# Altium schematic sheet Interface.SchDoc
size A4; SheetNumber: 2; SheetTotal: 5
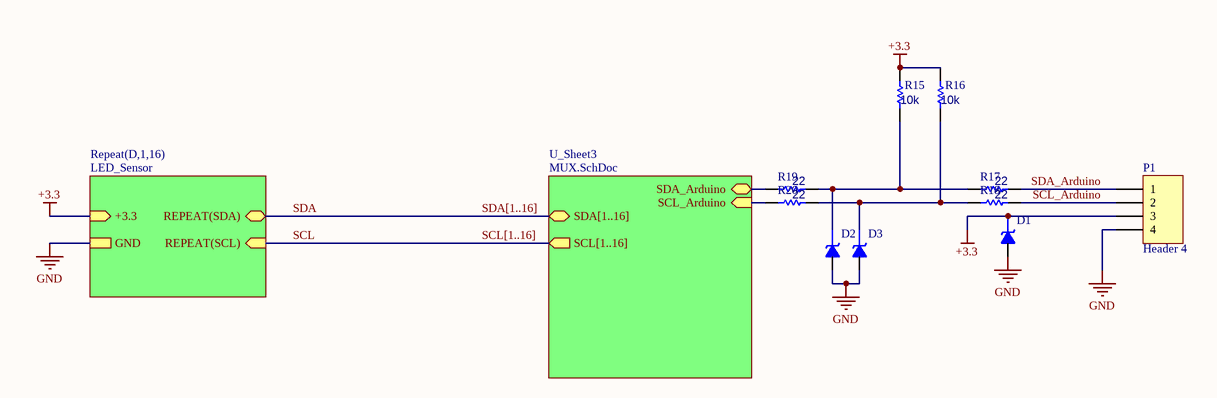
[diagram p0: Interface.SchDoc]

## Parts
D1  STS521033B950  [STS521033B950_COB]  (value not drawn)
D2  STS521033B950  [STS521033B950_COB]  (value not drawn)
D3  STS521033B950  [STS521033B950_COB]  (value not drawn)
P1  Header 4  [HDR1X4]
R15  value 10k  [R0603A]  (hidden comment: Resistor)
R16  value 10k  [R0603A]  (hidden comment: Resistor)
R17  value 22  [R0603A]  (hidden comment: Resistor)
R18  value 22  [R0603A]  (hidden comment: Resistor)
R19  value 22  [R0603A]  (hidden comment: Resistor)
R20  value 22  [R0603A]  (hidden comment: Resistor)

## Sub-sheets
Repeat(D,1,16) = LED_Sensor: REPEAT(SDA) (bidir), REPEAT(SCL) (in), +3.3 (in), GND
U_Sheet3 = MUX.SchDoc: SDA_Arduino (bidir), SCL_Arduino (in), SDA[1..16] (bidir), SCL[1..16] (out)

## Nets
+3.3: D1.1(K) P1.3 R15.2 R16.2 ; sheet Repeat(D,1,16)/+3.3
GND: D1.2(A) D2.2(A) D3.2(A) P1.4 ; sheet Repeat(D,1,16)/GND
SCL: sheet Repeat(D,1,16)/REPEAT(SCL)
SCL_Arduino: P1.2 R18.1
SDA: sheet Repeat(D,1,16)/REPEAT(SDA)
SDA_Arduino: P1.1 R17.1
NetD2_1: D2.1(K) R15.1 R17.2 R19.1
NetD3_1: D3.1(K) R16.1 R18.2 R20.1
NetR19_2: R19.2 ; sheet U_Sheet3/SDA_Arduino
NetR20_2: R20.2 ; sheet U_Sheet3/SCL_Arduino

## Buses and harness runs
bus SCL[1..16] = sheet U_Sheet3/SCL[1..16]
bus SDA[1..16] = sheet U_Sheet3/SDA[1..16]

## Library data of the parts
D1-D3 = CMP-245-000001-7: 3.3V ESD Diode; Mfr_Name: Eaton / Cooper Bussmann; Type: DEV; Copyright: Copyright (C) 2023 Ultra Librarian. All rights reserved.; RefDes: RefDes; Manufacturer_Part_Number: STS521033B950; Design Item ID: STS521033B950; Source: STS521033B950.SchLib
P1 = CMP-005-000097-2: Header, 4-Pin; Signal Integrity: Connector; LatestRevisionNote: Re-released for DXP Platform.; Pin Count: 4; Component Type: Standard; Publisher: Altium Limited; Source: Miscellaneous Connectors.SchLib; LatestRevisionDate: 17-Jul-2002; Design Item ID: Header 4
R15-R20 = CMP-009-00002-14